# EAGLE schematic Chase.g (EAGLE 7.0.0)

## Sheet 1 of 13
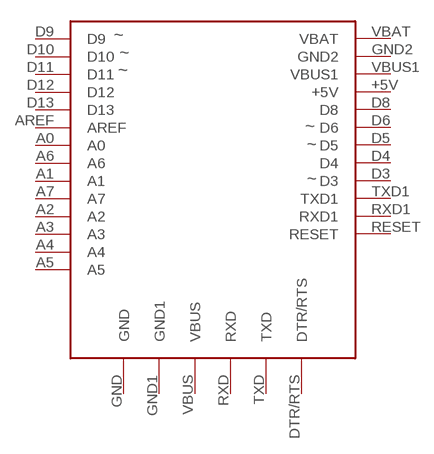
[diagram p0: schematic, sheet 1]

### Parts
U1_0_brain  ADAFRUIT-PRO-TRINKET-5V-BOB  [ADAFRUIT-PRO-TRINKET-5V]

### Nets
+5V_0_brain: U1_0_brain.+5V ; also sheet 5,6,7
A0_0_brain: U1_0_brain.A0 ; also sheet 12
A1_0_brain: U1_0_brain.A1 ; also sheet 13
A2_0_brain: U1_0_brain.A2 ; also sheet 6
A3_0_brain: U1_0_brain.A3 ; also sheet 7
A4_0_brain: U1_0_brain.A4
A5_0_brain: U1_0_brain.A5
A6_0_brain: U1_0_brain.A6
A7_0_brain: U1_0_brain.A7
AREF_0_brain: U1_0_brain.AREF
D3_0_brain: U1_0_brain.D3 ; also sheet 5
D4_0_brain: U1_0_brain.D4 ; also sheet 5
D5_0_brain: U1_0_brain.D5 ; also sheet 5
D6_0_brain: U1_0_brain.D6 ; also sheet 5
D8_0_brain: U1_0_brain.D8 ; also sheet 5
D9_0_brain: U1_0_brain.D9 ; also sheet 5
D10_0_brain: U1_0_brain.D10 ; also sheet 5
D11_0_brain: U1_0_brain.D11 ; also sheet 8
D12_0_brain: U1_0_brain.D12 ; also sheet 9
D13_0_brain: U1_0_brain.D13 ; also sheet 10
DTR/RTS_0_brain: U1_0_brain.DTR/RTS
GND_0_brain: U1_0_brain.GND U1_0_brain.GND1 U1_0_brain.GND2 ; also sheet 2,5,6,7,8,9,10,12,13
POS_1_battery: U1_0_brain.VBAT ; also sheet 2,5
RESET_0_brain: U1_0_brain.RESET
RXD1_0_brain: U1_0_brain.RXD1
RXD_0_brain: U1_0_brain.RXD
TXD1_0_brain: U1_0_brain.TXD1
TXD_0_brain: U1_0_brain.TXD
VBUS1_0_brain: U1_0_brain.VBUS1
VBUS_0_brain: U1_0_brain.VBUS

## Sheet 2 of 13
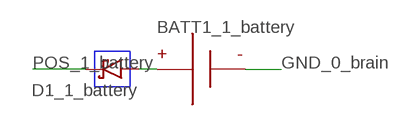
[diagram p1: schematic, sheet 2]

### Parts
BATT1_1_battery  BATTERY-9V-VERTICAL  [BATTERY_9V_KEYSTONE_968]
D1_1_battery  GENERIC-DIODE-SCHOTTKY_  (no package)

### Nets
GND_0_brain: BATT1_1_battery.N ; also sheet 1,5,6,7,8,9,10,12,13
N$1_1_battery: BATT1_1_battery.P D1_1_battery.A
POS_1_battery: D1_1_battery.C ; also sheet 1,5

## Sheet 3 of 13
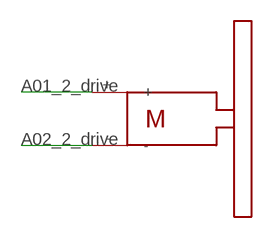
[diagram p2: schematic, sheet 3]

### Parts
R_2_drive  SOLARBOTICS_GM2SPARKFUN_HOBBY  [SPARKFUN_HOBBY_MOTOR]

### Nets
A01_2_drive: R_2_drive.+ ; also sheet 5
A02_2_drive: R_2_drive.- ; also sheet 5

## Sheet 4 of 13
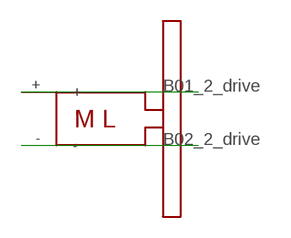
[diagram p3: schematic, sheet 4]

### Parts
L_2_drive  SOLARBOTICS_GM2_LEFTSPARKFUN_HOBBY  [SPARKFUN_HOBBY_MOTOR_LEFT]

### Nets
B01_2_drive: L_2_drive.+ ; also sheet 5
B02_2_drive: L_2_drive.- ; also sheet 5

## Sheet 5 of 13
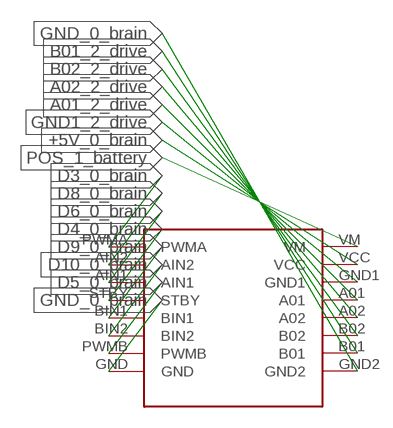
[diagram p4: schematic, sheet 5]

### Parts
DRVR_2_drive  SPARKFUN_DUAL_MOTOR_DRIVER-BOB  [SPARKFUN_DUAL_MOTOR_DRIVER]

### Nets
+5V_0_brain: DRVR_2_drive.VCC ; also sheet 1,6,7
A01_2_drive: DRVR_2_drive.A01 ; also sheet 3
A02_2_drive: DRVR_2_drive.A02 ; also sheet 3
B01_2_drive: DRVR_2_drive.B01 ; also sheet 4
B02_2_drive: DRVR_2_drive.B02 ; also sheet 4
D3_0_brain: DRVR_2_drive.PWMA ; also sheet 1
D4_0_brain: DRVR_2_drive.STBY ; also sheet 1
D5_0_brain: DRVR_2_drive.PWMB ; also sheet 1
D6_0_brain: DRVR_2_drive.AIN1 ; also sheet 1
D8_0_brain: DRVR_2_drive.AIN2 ; also sheet 1
D9_0_brain: DRVR_2_drive.BIN1 ; also sheet 1
D10_0_brain: DRVR_2_drive.BIN2 ; also sheet 1
GND1_2_drive: DRVR_2_drive.GND1
GND_0_brain: DRVR_2_drive.GND DRVR_2_drive.GND2 ; also sheet 1,2,6,7,8,9,10,12,13
POS_1_battery: DRVR_2_drive.VM ; also sheet 1,2

## Sheet 6 of 13
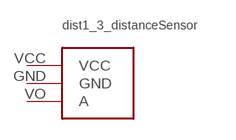
[diagram p5: schematic, sheet 6]

### Parts
dist1_3_distanceSensor  ANALOG_DISTANCE_SENSOR-GLUE  [ANALOG_DISTANCE_SENSOR_GLUE_MOUNT]

### Nets
+5V_0_brain: dist1_3_distanceSensor.VCC ; also sheet 1,5,7
A2_0_brain: dist1_3_distanceSensor.VO(A) ; also sheet 1
GND_0_brain: dist1_3_distanceSensor.GND ; also sheet 1,2,5,7,8,9,10,12,13

## Sheet 7 of 13
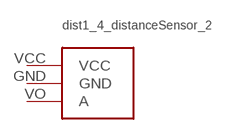
[diagram p6: schematic, sheet 7]

### Parts
dist1_4_distanceSensor_2  ANALOG_DISTANCE_SENSOR-GLUE  [ANALOG_DISTANCE_SENSOR_GLUE_MOUNT]

### Nets
+5V_0_brain: dist1_4_distanceSensor_2.VCC ; also sheet 1,5,6
A3_0_brain: dist1_4_distanceSensor_2.VO(A) ; also sheet 1
GND_0_brain: dist1_4_distanceSensor_2.GND ; also sheet 1,2,5,6,8,9,10,12,13

## Sheet 8 of 13
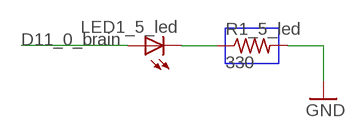
[diagram p7: schematic, sheet 8]

### Parts
LED1_5_led  LED5MM  [LED5MM]
R1_5_led  330  GENERIC-RESISTOR_  (no package)

### Nets
D11_0_brain: LED1_5_led.A ; also sheet 1
GND_0_brain: R1_5_led.2 ; supply symbol labelled GND ; also sheet 1,2,5,6,7,9,10,12,13
N$1_5_led: LED1_5_led.K(C) R1_5_led.1

## Sheet 9 of 13
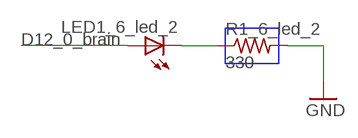
[diagram p8: schematic, sheet 9]

### Parts
LED1_6_led_2  LED5MM  [LED5MM]
R1_6_led_2  330  GENERIC-RESISTOR_  (no package)

### Nets
D12_0_brain: LED1_6_led_2.A ; also sheet 1
GND_0_brain: R1_6_led_2.2 ; supply symbol labelled GND ; also sheet 1,2,5,6,7,8,10,12,13
N$1_6_led_2: LED1_6_led_2.K(C) R1_6_led_2.1

## Sheet 10 of 13
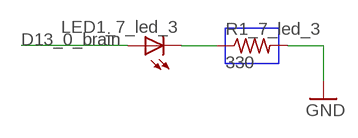
[diagram p9: schematic, sheet 10]

### Parts
LED1_7_led_3  LED5MM  [LED5MM]
R1_7_led_3  330  GENERIC-RESISTOR_  (no package)

### Nets
D13_0_brain: LED1_7_led_3.A ; also sheet 1
GND_0_brain: R1_7_led_3.2 ; supply symbol labelled GND ; also sheet 1,2,5,6,7,8,9,12,13
N$1_7_led_3: LED1_7_led_3.K(C) R1_7_led_3.1

## Sheet 11 of 13
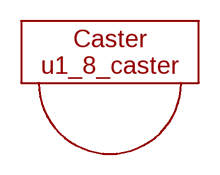
[diagram p10: schematic, sheet 11]

### Parts
u1_8_caster  CASTERADAFRUIT-3/4IN  [ADAFRUIT-3/4IN-CASTER]

## Sheet 12 of 13
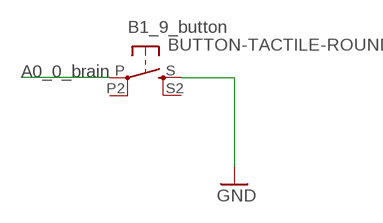
[diagram p11: schematic, sheet 12]

### Parts
B1_9_button  BUTTON-TACTILE-ROUND  [BUTTON-TACTILE-ROUND-ADAFRUIT1009]

### Nets
A0_0_brain: B1_9_button.P ; also sheet 1
GND_0_brain: B1_9_button.S ; supply symbol labelled GND ; also sheet 1,2,5,6,7,8,9,10,13
Unconnected: B1_9_button.P2(P1) B1_9_button.S2(S1)

## Sheet 13 of 13
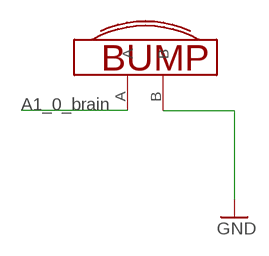
[diagram p12: schematic, sheet 13]

### Parts
U$2_10_bump  BUMP_SWITCH-MEDIUM-RIGHT  [BUMP_SWITCH_OMRON_D2FLA1]

### Nets
A1_0_brain: U$2_10_bump.A ; also sheet 1
GND_0_brain: U$2_10_bump.B ; supply symbol labelled GND ; also sheet 1,2,5,6,7,8,9,10,12

## Library data of the parts
B1_9_button = Components:BUTTON-TACTILE; DIST: Adafruit; DISTPN: 1009; HIERARCHY_NAME: button.B1
BATT1_1_battery = Components:BATTERY; HIERARCHY_NAME: battery.BATT1
D1_1_battery = KoalaDesign:GENERIC-DIODE-SCHOTTKY_: Schottky diode; HIERARCHY_NAME: battery.D1; VREV: >9V
dist1_3_distanceSensor = Components:ANALOG_DISTANCE_SENSOR; DIST: Pololu; DISTPN: 2450; HIERARCHY_NAME: distanceSensor.dist1
dist1_4_distanceSensor_2 = Components:ANALOG_DISTANCE_SENSOR; DIST: Pololu; DISTPN: 2450; HIERARCHY_NAME: distanceSensor_2.dist1
DRVR_2_drive = BOBs:SPARKFUN_DUAL_MOTOR_DRIVER: SF Dual Motor Driver; DIST: Sparkfun; DISTPN: 9457; HIERARCHY_NAME: drive.DRVR
L_2_drive = Components:SOLARBOTICS_GM2_LEFT; HIERARCHY_NAME: drive.L
LED1_5_led = Components:LED: LED OSRAM: - CHIPLED LG R971, LG N971, LY N971, LG Q971, LY Q971, LO R971, LY R971 LH N974, LH R974 LS Q976, LO Q976, LY Q976 LO Q996 - Hyper CHIPLED LW Q18S LB Q993, LB Q99A, LB R99A - SideLED LS A670, LO A670, LY A670, LG A670, LP A670 LB A673, LV A673, LT A673, LW A673 LH A674 LY A675 LS A676, LA A676, LO A676, LY A676, LW A676 LS A679, LY A679, LG A679 - Hyper Micro SIDELED® LS Y876, LA Y876, LO Y876, LY Y876 LT Y87S - SmartLED LW L88C, LW L88S LB L89C, LB L89S, LG L890 LS L89K, LO L89K, LY L89K LS L896, LA L896, LO L896, LY L896 - TOPLED LS T670, LO T670, LY T670, LG T670, LP T670 LSG T670, LSP T670, LSY T670, LOP T670, LYG T670 LG T671, LOG T671, LSG T671 LB T673, LV T673, LT T673, LW T673 LH T674 LS T676, LA T676, LO T676, LY T676, LB T676, LH T676, LSB T676, LW T676 LB T67C, LV T67C, LT T67C, LS T67K, LO T67K, LY T67K, LW E67C LS E67B, LA E67B, LO E67B, LY E67B, LB E67C, LV E67C, LT E67C LW T67C LS T679, LY T679, LG T679 LS T770, LO T770, LY T770, LG T770, LP T770 LB T773, LV T773, LT T773, LW T773 LH T774 LS E675, LA E675, LY E675, LS T675 LS T776, LA T776, LO T776, LY T776, LB T776 LHGB T686 LT T68C, LB T68C - Hyper Mini TOPLED® LB M676 - Mini TOPLED Santana® LG M470 LS M47K, LO M47K, LY M47K Source: http://www.osram.convergy.de/; DIST: Adafruit; DISTPN: 298; HIERARCHY_NAME: led.LED1
LED1_6_led_2 = Components:LED: LED OSRAM: - CHIPLED LG R971, LG N971, LY N971, LG Q971, LY Q971, LO R971, LY R971 LH N974, LH R974 LS Q976, LO Q976, LY Q976 LO Q996 - Hyper CHIPLED LW Q18S LB Q993, LB Q99A, LB R99A - SideLED LS A670, LO A670, LY A670, LG A670, LP A670 LB A673, LV A673, LT A673, LW A673 LH A674 LY A675 LS A676, LA A676, LO A676, LY A676, LW A676 LS A679, LY A679, LG A679 - Hyper Micro SIDELED® LS Y876, LA Y876, LO Y876, LY Y876 LT Y87S - SmartLED LW L88C, LW L88S LB L89C, LB L89S, LG L890 LS L89K, LO L89K, LY L89K LS L896, LA L896, LO L896, LY L896 - TOPLED LS T670, LO T670, LY T670, LG T670, LP T670 LSG T670, LSP T670, LSY T670, LOP T670, LYG T670 LG T671, LOG T671, LSG T671 LB T673, LV T673, LT T673, LW T673 LH T674 LS T676, LA T676, LO T676, LY T676, LB T676, LH T676, LSB T676, LW T676 LB T67C, LV T67C, LT T67C, LS T67K, LO T67K, LY T67K, LW E67C LS E67B, LA E67B, LO E67B, LY E67B, LB E67C, LV E67C, LT E67C LW T67C LS T679, LY T679, LG T679 LS T770, LO T770, LY T770, LG T770, LP T770 LB T773, LV T773, LT T773, LW T773 LH T774 LS E675, LA E675, LY E675, LS T675 LS T776, LA T776, LO T776, LY T776, LB T776 LHGB T686 LT T68C, LB T68C - Hyper Mini TOPLED® LB M676 - Mini TOPLED Santana® LG M470 LS M47K, LO M47K, LY M47K Source: http://www.osram.convergy.de/; DIST: Adafruit; DISTPN: 298; HIERARCHY_NAME: led_2.LED1
LED1_7_led_3 = Components:LED: LED OSRAM: - CHIPLED LG R971, LG N971, LY N971, LG Q971, LY Q971, LO R971, LY R971 LH N974, LH R974 LS Q976, LO Q976, LY Q976 LO Q996 - Hyper CHIPLED LW Q18S LB Q993, LB Q99A, LB R99A - SideLED LS A670, LO A670, LY A670, LG A670, LP A670 LB A673, LV A673, LT A673, LW A673 LH A674 LY A675 LS A676, LA A676, LO A676, LY A676, LW A676 LS A679, LY A679, LG A679 - Hyper Micro SIDELED® LS Y876, LA Y876, LO Y876, LY Y876 LT Y87S - SmartLED LW L88C, LW L88S LB L89C, LB L89S, LG L890 LS L89K, LO L89K, LY L89K LS L896, LA L896, LO L896, LY L896 - TOPLED LS T670, LO T670, LY T670, LG T670, LP T670 LSG T670, LSP T670, LSY T670, LOP T670, LYG T670 LG T671, LOG T671, LSG T671 LB T673, LV T673, LT T673, LW T673 LH T674 LS T676, LA T676, LO T676, LY T676, LB T676, LH T676, LSB T676, LW T676 LB T67C, LV T67C, LT T67C, LS T67K, LO T67K, LY T67K, LW E67C LS E67B, LA E67B, LO E67B, LY E67B, LB E67C, LV E67C, LT E67C LW T67C LS T679, LY T679, LG T679 LS T770, LO T770, LY T770, LG T770, LP T770 LB T773, LV T773, LT T773, LW T773 LH T774 LS E675, LA E675, LY E675, LS T675 LS T776, LA T776, LO T776, LY T776, LB T776 LHGB T686 LT T68C, LB T68C - Hyper Mini TOPLED® LB M676 - Mini TOPLED Santana® LG M470 LS M47K, LO M47K, LY M47K Source: http://www.osram.convergy.de/; DIST: Adafruit; DISTPN: 298; HIERARCHY_NAME: led_3.LED1
R1_5_led = KoalaDesign:GENERIC-RESISTOR_: Resistor; HIERARCHY_NAME: led.R1
R1_6_led_2 = KoalaDesign:GENERIC-RESISTOR_: Resistor; HIERARCHY_NAME: led_2.R1
R1_7_led_3 = KoalaDesign:GENERIC-RESISTOR_: Resistor; HIERARCHY_NAME: led_3.R1
R_2_drive = Components:SOLARBOTICS_GM2; HIERARCHY_NAME: drive.R
U1_0_brain = BOBs:ADAFRUIT-PRO-TRINKET-5V: Adafruit Pro Trinket - 5V 16MHz; DIST: Adafruit; DISTPN: 2000; HIERARCHY_NAME: brain.U1
u1_8_caster = Components:CASTER; DIST: Adafruit; DISTPN: 1200; HIERARCHY_NAME: caster.u1
U$2_10_bump = Components:BUMP_SWITCH; DIST: Digikey; DISTPN: SW842-ND; HIERARCHY_NAME: bump.U$2